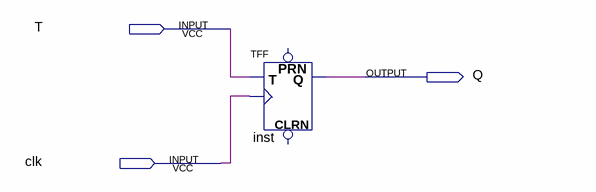
[diagram p0: schematic sheet]
// Quartus schematic T_ff_altera.bdf as structural Verilog: 1 symbols, 3 pins
module T_ff_altera (
  input  T,
  input  clk,
  output Q
);

  TFF inst (.T(T), .CLK(clk), .Q(Q));  // open: PRN, CLRN
endmodule
